# EAGLE design usb (EAGLE 7.5.0)
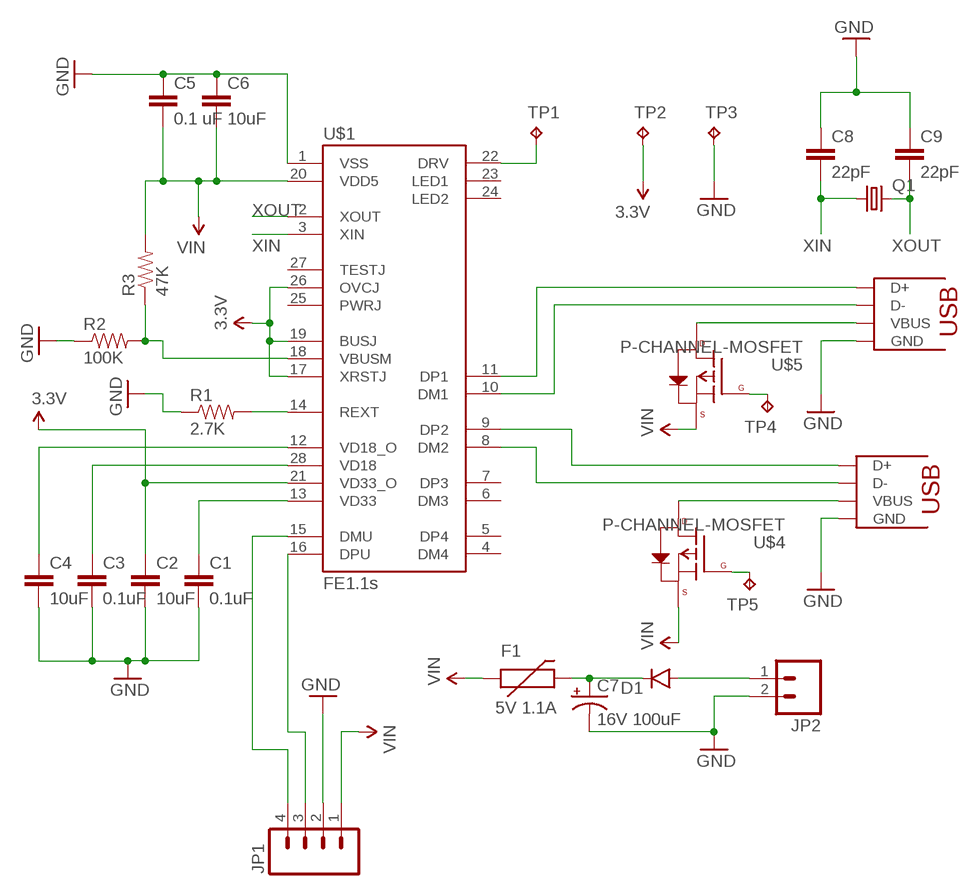
[diagram p0: schematic, sheet 1]

## Parts
C1  0.1uF  CAP1206  [1206]
C2  10uF  CAP1206  [1206]
C3  0.1uF  CAP1206  [1206]
C4  10uF  CAP1206  [1206]
C5  0.1 uF  CAP1206  [1206]
C6  10uF  CAP1206  [1206]
C7  16V 100uF  CAP_POLD  [PANASONIC_D]
C8  22pF  CAP1206  [1206]
C9  22pF  CAP1206  [1206]
D1  DIODESMA  [SMA-DIODE]
F1  5V 1.1A  PTCSMD  [PTC-1206]
JP1  M04LONGPADS  [1X04_LONGPADS]
JP2  M02PTH  [1X02]
Q1  CRYSTALCTS406  [CTS406]
R1  2.7K  RESISTOR1206  [1206]
R2  100K  RESISTOR1206  [1206]
R3  47K  RESISTOR1206  [1206]
TP1  TP_DRV  TPB2,54  [B2,54]
TP2  TP_DRV  TPB2,54  [B2,54]
TP3  TP_DRV  TPB2,54  [B2,54]
TP4  TP_DRV  TPB2,54  [B2,54]
TP5  TP_DRV  TPB2,54  [B2,54]
U$1  FE1.1S  [FE1.1S_SSOP-28]
U$2  USB-A-S  [USB-A-S-RA-PTH]
U$3  USB-A-S  [USB-A-S-RA-PTH]
U$4  P-CHANNEL-MOSFET  [SOT23-3]
U$5  P-CHANNEL-MOSFET  [SOT23-3]

## Nets
3.3V: C2.1 TP2.TP U$1.17(XRSTJ) U$1.19(BUSJ) U$1.21(VD33_O) U$1.26(OVCJ)
GND: C1.2 C2.2 C3.2 C4.2 C5.1 C6.1 C7.- C8.1 C9.1 JP1.2 JP2.2 R1.1 R2.1 TP3.TP U$1.1(VSS) U$2.GND U$2.GND2(GND) U$2.GND3(GND) U$3.GND U$3.GND2(GND) U$3.GND3(GND)
N$1: C1.1 U$1.13(VD33)
N$2: TP1.TP U$1.22(DRV)
N$3: C3.1 U$1.28(VD18)
N$4: C4.1 U$1.12(VD18_O)
N$5: D1.A JP2.1
N$6: C7.+ D1.C F1.2
N$7: R1.2 U$1.14(REXT)
N$8: U$3.VBUS U$4.3(D)
N$9: R2.2 R3.1 U$1.18(VBUSM)
N$10: U$2.VBUS U$5.3(D)
N$11: TP5.TP U$4.1(G)
N$12: TP4.TP U$5.1(G)
USB1_N: U$1.10(DM1) U$2.D-
USB1_P: U$1.11(DP1) U$2.D+
USB2_N: U$1.8(DM2) U$3.D-
USB2_P: U$1.9(DP2) U$3.D+
USBIN_N: JP1.4 U$1.15(DMU)
USBIN_P: JP1.3 U$1.16(DPU)
VIN: C5.2 C6.2 F1.1 JP1.1 R3.2 U$1.20(VDD5) U$4.2(S) U$5.2(S)
XIN: C8.2 Q1.1 U$1.3(XIN)
XOUT: C9.2 Q1.3 U$1.2(XOUT)
Unconnected: U$1.4(DM4) U$1.5(DP4) U$1.6(DM3) U$1.7(DP3) U$1.23(LED1) U$1.24(LED2) U$1.25(PWRJ) U$1.27(TESTJ)

## Library data of the parts
C1 C3 C5 = SparkFun-Capacitors:CAP: Capacitor Standard 0603 ceramic capacitor, and 0.1" leaded capacitor.; MF: TDK; MPN: CGA5L2C0G1H104J160AA; OC_FARNELL: 2211074
C2 C4 C6 = SparkFun-Capacitors:CAP: Capacitor Standard 0603 ceramic capacitor, and 0.1" leaded capacitor.; MF: TAIYO YUDEN; MPN: GMK316F106ZL-T; OC_FARNELL: 1611967
C7 = SparkFun-Capacitors:CAP_POL: Capacitor Polarized These are standard SMD and PTH capacitors. Normally 10uF, 47uF, and 100uF in electrolytic and tantalum varieties. Always verify the external diameter of the through hole cap, it varies with capacity, voltage, and manufacturer. The EIA devices should be standard.; MF: PANASONIC ELECTRONIC COMPONENTS; MPN: EEEHA1C101WP; OC_FARNELL: 1973308
C8 C9 = SparkFun-Capacitors:CAP: Capacitor Standard 0603 ceramic capacitor, and 0.1" leaded capacitor.; MF: AVX; MPN: 12061A220JAT2A; OC_FARNELL: 499249
D1 = SparkFun-DiscreteSemi:DIODE: Diode These are standard reverse protection diodes and small signal diodes. SMA package can handle up to about 1A. SOD-323 can handle about 200mA. What the SOD-323 package when ordering, there are some mfgs out there that are 5-pin packages.; MF: MULTICOMP; MPN: SMAJ5.0A; OC_FARNELL: 1578997
F1 = SparkFun-PowerIC:PTC: Resettable Fuse PTC Resettable Fuse. Spark Fun Electronics SKU : COM-08357; OC_FARNELL: unknown; PROD_ID: RES-11150
JP1 = SparkFun-Connectors:M04: Header 4 Standard 4-pin 0.1" header. Use with straight break away headers (SKU : PRT-00116), right angle break away headers (PRT-00553), swiss pins (PRT-00743), machine pins (PRT-00117), and female headers (PRT-00115). Molex polarized connector foot print use with SKU : PRT-08231 with associated crimp pins and housings. 1MM SMD Version SKU: PRT-10208; OC_FARNELL: unknown
JP2 = SparkFun-Connectors:M02: Standard 2-pin 0.1" header. Use with - straight break away headers ( PRT-00116) - right angle break away headers (PRT-00553) - swiss pins (PRT-00743) - machine pins (PRT-00117) - female headers (PRT-00115) Molex polarized connector foot print use with: PRT-08233 with associated crimp pins and housings. 2.54_SCREWTERM for use with PRT-10571. 3.5mm Screw Terminal footprints for PRT-08084 5mm Screw Terminal footprints for use with PRT-08432; OC_FARNELL: unknown
Q1 = crystal:CRYSTAL: CRYSTAL; MF: ABRACON; MPN: ABM3B-12.000MHZ-B2-T; OC_FARNELL: 1611810; OC_NEWARK: unknown
R1 = SparkFun-Passives:RESISTOR: Resistor Basic schematic elements and footprints for 0603, 1206, and PTH resistors.; MF: WELWYN; MPN: WCR1206-2K7FI; OC_FARNELL: 1100202
R2 = SparkFun-Passives:RESISTOR: Resistor Basic schematic elements and footprints for 0603, 1206, and PTH resistors.; MF: VISHAY; MPN: CRCW1206100KFKEA; OC_FARNELL: 1469975
R3 = SparkFun-Passives:RESISTOR: Resistor Basic schematic elements and footprints for 0603, 1206, and PTH resistors.; MF: VISHAY; MPN: CRCW120647K0FKEA; OC_FARNELL: 1470016
TP1-TP5 = testpad:TP: Test pad; OC_FARNELL: unknown
U$1 = imcom:FE1.1S: A USB 2.0 hub IC. http://www.jfd-ic.com/Documents/FE1.1s%20Data%20Sheet%20%28Rev.%201.0%29.pdf; OC_FARNELL: unknown
U$2 U$3 = pimoroni:USB-A-S; OC_FARNELL: unknown
U$4 U$5 = GeekAmmo:P-CHANNEL-MOSFET: P-Channel MOSFET Mode Field Effect Transistor; MF: VISHAY; MPN: SI2301CDS-T1-E3; OC_FARNELL: 2335284

## Board
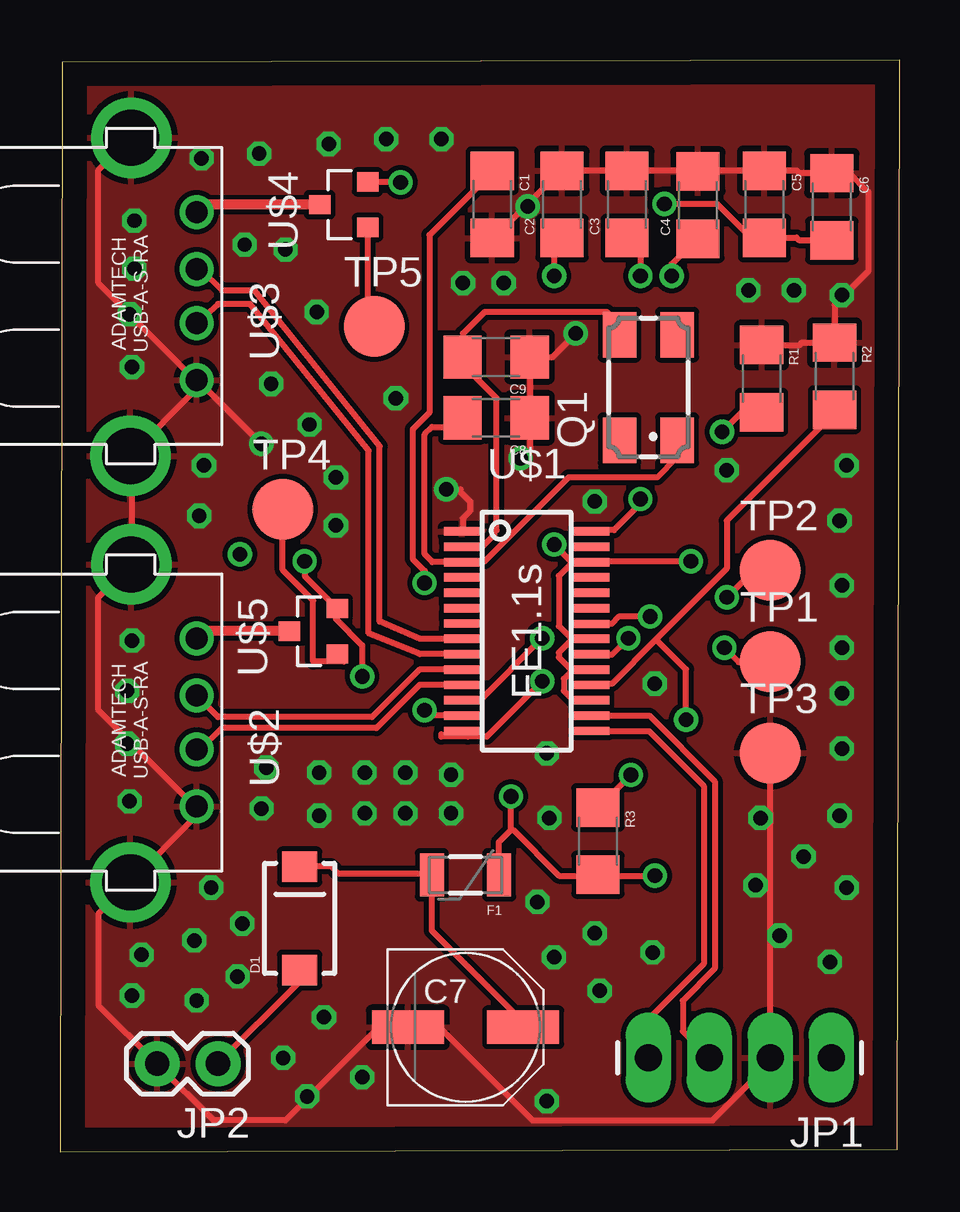
[diagram p1: board, top side]
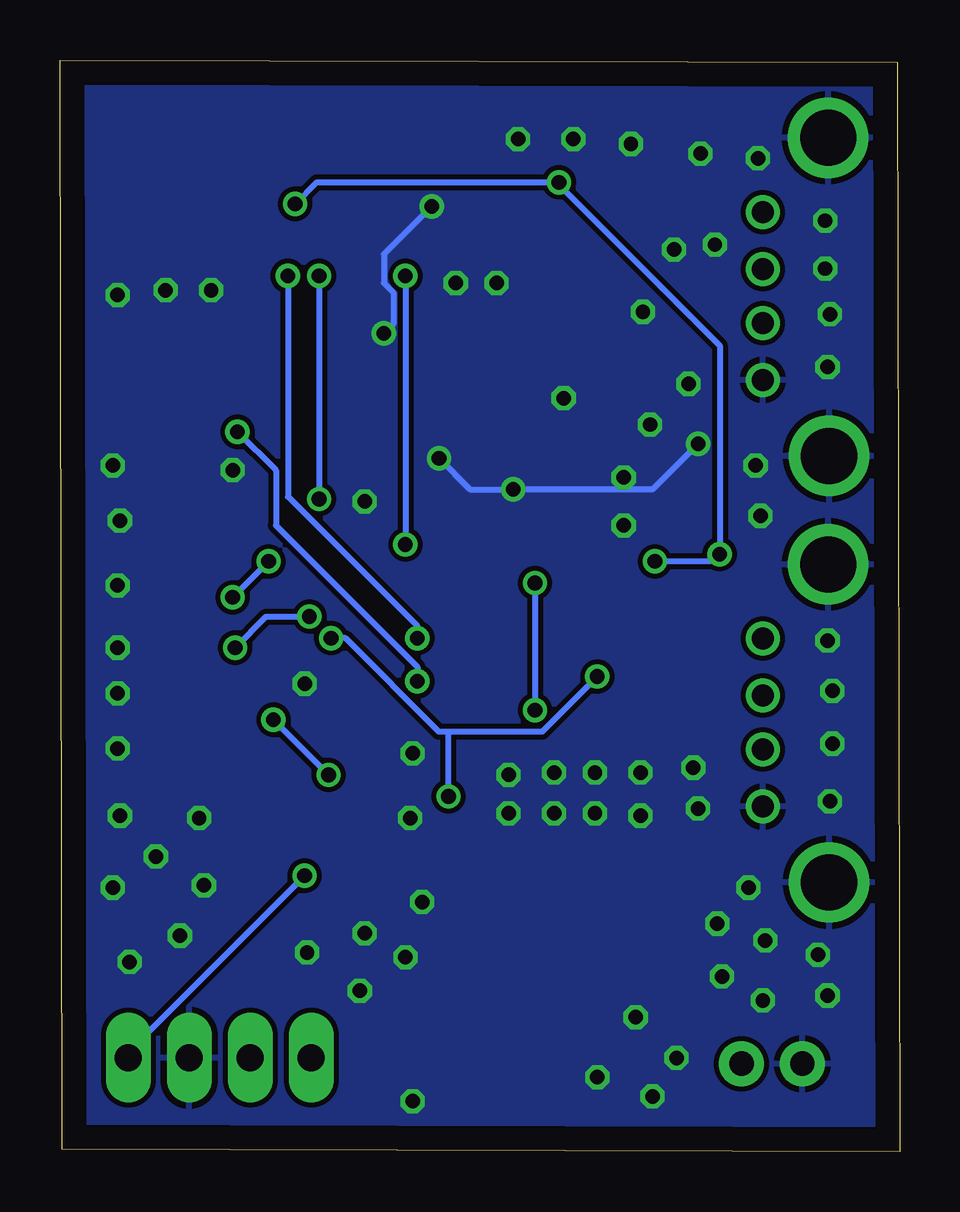
[diagram p2: board, bottom side, seen from below]

Size 35 x 45.5 mm. Coordinates in mm from the lower left corner, seen from the top.
Outline: 0,0 34.9,0.1 35,45.5 0.1,45.4 0,0
Copper layers (1*16): Top 0.035mm / dielectric 1.5mm / Bottom 0.035mm
Design rules "default": minimum track width 10mil, minimum drill 24mil, track to track 8mil, track to pad 8mil, pad to pad 8mil, via to via 8mil, smd to smd 8mil, copper to edge 40mil, drill to drill 8mil, minimum pad ring 10mil, minimum via ring 8mil, stop-mask expansion 4mil, vias tented up to drill 0mil, thermal gap 10mil

### Footprints (pad centres in the part's own frame; a part is rotated, then mirrored left to right if it is on the bottom)
1206 = smd 1.6 x 1.8: 1 -1.4,0; 2 1.4,0
PANASONIC_D = smd 3 x 1.4: + 2.4,0; - -2.4,0
SMA-DIODE = smd 1.27 x 1.47: A -2.15,0; C 2.15,0
PTC-1206 = smd 1 x 1.8: 1 -1.4,0; 2 1.4,0
1X04_LONGPADS = drill 1.118 pad 1.88 long: 1 0,0; 2 2.54,0; 3 5.08,0; 4 7.62,0
1X02 = drill 1.016 pad 1.88: 1 0,0; 2 2.54,0
CTS406 = smd 1.9 x 1.4: 1 -2.2,-1.2; 2 2.2,-1.2; 3 2.2,1.2; 4 -2.2,1.2
B2,54 = smd 2.54 x 2.54: TP 0,0
FE1.1S_SSOP-28 = smd 0.35 x 1.5: 1 -4.16,-2.7; 2 -3.52,-2.7; 3 -2.88,-2.7; 4 -2.24,-2.7; 5 -1.6,-2.7; 6 -0.96,-2.7; 7 -0.32,-2.7; 8 0.32,-2.7; 9 0.96,-2.7; 10 1.6,-2.7; 11 2.24,-2.7; 12 2.88,-2.7; 13 3.52,-2.7; 14 4.16,-2.7; 15 4.16,2.7; 16 3.52,2.7; 17 2.88,2.7; 18 2.24,2.7; 19 1.6,2.7; 20 0.96,2.7; 21 0.32,2.7; 22 -0.3,2.7; 23 -0.96,2.7; 24 -1.6,2.7; 25 -2.24,2.7; 26 -2.88,2.7; 27 -3.52,2.7; 28 -4.16,2.7
USB-A-S-RA-PTH = drill 0.914 pad 1.27: D+ 2.755,-1.127; D- 2.755,1.127; GND 2.755,-3.5; VBUS 2.755,3.5 | drill 2.337 pad 3.302: GND2 -0.003,-6.662; GND3 0.032,6.597
SOT23-3 = smd 0.8 x 0.9: 1 -0.95,-1; 2 0.95,-1; 3 0,1

### Placement (x,y rotation side)
C1  18.02,39.48 270 top
C2  20.93,39.48 90 top
C3  23.64,39.48 90 top
C4  26.59,39.45 90 top
C5  29.37,39.48 270 top
C6  32.18,39.38 270 top
C7  16.91,5.18 0 top
C8  18.18,30.58 180 top
C9  18.18,33.12 180 top
D1  9.99,9.72 90 top
F1  16.91,11.53 180 top
JP1  32.15,3.91 180 top
JP2  6.59,3.66 180 top
Q1  24.53,31.85 90 top
R1  29.25,32.22 270 top
R2  32.29,32.32 270 top
R3  22.43,12.94 270 top
TP1  29.61,20.42 0 top
TP2  29.61,24.23 0 top
TP3  29.61,16.61 0 top
TP4  9.29,26.77 0 top
TP5  13.1,34.39 0 top
U$1  19.45,21.69 270 top
U$2  2.94,17.88 0 top
U$3  2.94,35.66 0 top
U$4  11.83,39.47 90 top
U$5  10.56,21.69 90 top

### Tracks (layer width: path | path; a pad name or v marks a point on that pad's centre or on a via)
3.3V  (via drill 0.61)
  Top 0.254: 21.3,24.6 22.1,24.6 U$1.26 22.2,24.6 v26.3,24.6 | v20.6,25.3 21.3,24.6 | v20.6,36.5 20.6,38 20.7,38.1 20.9,38.1 C2.1 | 21.3,21.4 22.1,21.4 U$1.21 | 21.3,21.4 20.8,21.9 20.8,24 21.3,24.5 21.3,24.6 | 21.3,20.1 22.1,20.1 U$1.19 | 21.3,20.1 20.8,20.6 20.8,20.8 21.3,21.3 21.3,21.4 | U$1.17 22.1,18.8 21.4,18.8 21,19.2 21,19.7 21.3,20 21.3,20.1 | v27.8,23.1 28.9,24.2 29.6,24.2 TP2.TP
  Bottom 0.254: v20.6,36.5 v20.6,25.3 | v27.8,23.1 v26.3,24.6
GND  (via drill 0.6, 0.61)
  Top 0.254: 19.45,39.45 20.2,40.2 20.2,40.8 20.3,40.9 20.8,40.9 C2.2 21,40.9 23.6,40.9 C3.2 23.7,40.9 26.5,40.9 C4.2 26.7,40.9 29.3,40.9 C5.1 29.5,40.9 30.7,40.9 30.8,40.8 32.1,40.8 C6.1 32.3,40.8 32.9,40.8 33.7,40 33.7,36.7 32.3,35.3 32.3,33.8 R2.1 32.2,33.7 30.9,33.7 30.8,33.6 29.3,33.6 R1.1 | 19.45,39.45 18.1,38.1 C1.2 | v21.5,34.1 20.5,33.1 19.7,33.1 C9.1 19.6,33.1 19.6,30.6 C8.1 19.6,30.5 19.6,29.2 19.4,29 19.3,29 v19.2,28.9 | v19.5,39.4 19.45,39.45 | U$3.GND 5.6,32.1 5.6,31.7 3,29.1 U$3.GND2 3,28.9 3,24.6 U$2.GND3 2.9,24.4 1.6,23.1 1.6,18.4 5.6,14.4 U$2.GND 5.6,14.3 5.6,13.9 3,11.3 U$2.GND2 2.9,11.2 1.6,9.9 1.6,6.1 4,3.7 JP2.2 4.1,3.6 6.4,1.3 9.4,1.3 13.3,5.2 14.5,5.2 C7.- 14.6,5.2 15.8,5.2 19.7,1.3 27.2,1.3 29.6,3.7 JP1.2 29.6,4 29.6,16.5 29.5,16.6 29.6,16.7 TP3.TP | U$3.GND3 2.9,42.2 1.6,40.9 1.6,36.2 5.6,32.2 U$3.GND | v16.1,27.6 16.7,27.6 16.7,27.5 17.1,27.1 17.1,26.7 16.8,26.4 16.8,25.9 U$1.1 | v8.4,29.5 5.8,32.1 U$3.GND
  Bottom 0.254: v21.5,34.1 21.1,34.5 21.1,35.8 21.5,36.2 21.5,37.4 v19.5,39.4 | v8.4,29.5 10.3,27.6 v16.1,27.6 17.9,27.6 v19.2,28.9
  other vias: 10.8,15.8 12.7,15.8 14.4,15.8 16.3,15.7 16.3,14.1 14.4,14.1 12.7,14.1 10.8,14 8.4,14.3 8.6,16 6.3,11 7.6,9.5 5.6,8.8 7.4,7.3 5.7,6.3 3.4,8.2 3,6.5 9.3,3.9 11,5.6 12.6,3.1 10.3,2.3 20.3,2.1 22.5,6.7 20.6,8.1 22.3,9.1 24.7,8.3 19.9,10.4 29,11.1 30,9 32.1,7.9 32.8,11 32.5,14 31,12.3 29.2,13.9 32.6,16.8 32.6,19.1 32.6,21 32.6,23.6 32.5,26.3 32.8,28.6 27.8,28.4 32.6,35.7 30.6,35.9 28.7,35.9 18.5,36.2 16.8,36.2 8.8,32 10.4,30.3 11.5,28.1 11.5,26.1 14,31.4 10.7,35 9.4,37.6 7.7,37.8 3.1,38.8 3.1,36.8 2.9,34.9 3,32.7 6,28.6 5.8,26.5 3,21.3 2.8,19.2 2.8,17 2.9,14.6 5.9,41.4 8.3,41.6 11.2,42 13.6,42.2 15.9,42.2 22.3,27.1 24.8,19.5 20.3,16.6 20.4,13.9
  pour Top: 0,0 35,0.1 35.2,45.4 0,45.3
  pour Bottom: 0.3,45.2 35.1,45.3 35,44.3 34.9,44.3 34.9,0.1 0.2,0
N$1  (via drill 0.61)
  Top 0.254: v15.2,18.4 15.4,18.2 16.7,18.2 U$1.13 | v15.2,23.7 15.2,24.2 14.7,24.7 14.7,30.1 15.4,30.8 15.4,38.2 18,40.8 C1.1
  Bottom 0.254: v15.2,23.7 v15.2,18.4
N$2  (via drill 0.61)
  Top 0.254: v24.6,22.3 23.3,22.3 23,22 22.2,22 U$1.22 | v27.7,21 28.3,20.4 29.6,20.4 TP1.TP
  Bottom 0.254: v24.6,22.3 26.4,22.3 v27.7,21
N$3  (via drill 0.61)
  Top 0.254: 24.2,26.9 v24.2,27.2 24.1,26.9 23.1,25.9 22.2,25.9 U$1.28 | v24.2,36.5 24.2,38 24.1,38.1 23.7,38.1 C3.1
  Bottom 0.254: v24.2,36.5 v24.2,27.2
N$4  (via drill 0.61)
  Top 0.254: v20.1,21.4 17.5,18.8 16.8,18.8 U$1.12 | v25.5,36.5 25.5,37 26.5,38 C4.1
  Bottom 0.254: v20.1,21.4 20.1,21.9 25.5,27.3 v25.5,36.5
N$5
  Top 0.254: D1.A 9.9,7.5 9.9,7 6.6,3.7 JP2.1
N$6
  Top 0.254: D1.C 10,11.9 11.3,11.9 11.6,11.6 15.5,11.6 F1.2 15.5,11.5 15.5,9.2 19.5,5.2 19.4,5.1 C7.+
N$7  (via drill 0.61)
  Top 0.254: 15.9,17.4 15.9,17.3 17,17.3 | 17,17.3 17.8,17.3 v20.1,19.6 | v27.6,30 28.4,30.8 29.2,30.8 R1.2 | U$1.14 16.8,17.5 16.9,17.5 17,17.4 17,17.3
  Bottom 0.254: v20.1,19.6 20.1,20.2 26,26.1 26,28.4 v27.6,30
N$8
  Top 0.406: U$4.3 5.48,39.47 U$3.VBUS
N$9  (via drill 0.61)
  Top 0.254: 24.85,21.35 27.8,24.3 27.8,26.3 32.4,30.9 32.3,31 R2.2 | 24.85,21.35 23,19.5 22.2,19.5 U$1.18 | v26.1,18 26.1,20.1 24.85,21.35 | v23.8,15.7 22.5,14.4 R3.1
  Bottom 0.254: v23.8,15.7 v26.1,18
N$10
  Top 0.406: U$5.3 5.48,21.69 U$2.VBUS
N$11
  Top 0.254: U$4.1 12.83,34.66 TP5.TP
N$12
  Top 0.254: U$5.1 11.83,20.42 10.56,20.42 10.56,22.96 9.29,24.23 TP4.TP
USB1_N
  Top 0.254: U$1.10 14.99,20.09 13.01,18.11 6.59,18.11 U$2.D-
USB1_P
  Top 0.254: U$1.11 14.99,19.45 13.2,17.65 6.75,17.65 5.85,16.75 U$2.D+
USB2_N
  Top 0.254: U$1.8 15.01,21.37 13.33,22.09 13.33,29.41 8.12,35.89 6.75,35.89 5.85,36.79 U$3.D-
USB2_P
  Top 0.254: U$1.9 15.01,20.73 12.87,21.6 12.87,29.21 7.93,35.33 6.59,35.33 U$3.D+
USBIN_N
  Top 0.254: U$1.15 24.56,17.53 26.84,15.24 26.84,7.81 24.53,5.5 JP1.4
USBIN_P
  Top 0.254: U$1.16 24.56,18.17 27.3,15.44 27.3,7.62 25.96,6.29 25.96,5.02 JP1.3
VIN  (via drill 0.61)
  Top 0.254: C6.2 32.1,38 30.8,38 30.7,38.1 29.4,38.1 C5.2 29.3,38.1 28.8,38.1 27.4,39.5 v25.2,39.5 | v14.2,40.4 12.9,40.4 U$4.2 | v10.2,24.6 10.2,24 U$5.2 11.4,22.7 11.4,22.6 11.5,22.5 11.5,22.2 12.6,21.1 v12.6,19.8 | v23.7,21.4 23,20.7 22.2,20.7 U$1.20 | 18.8,13.4 v18.8,14.8 | 18.8,13.4 18.3,12.9 18.3,11.6 F1.1 | R3.2 22.4,11.5 20.8,11.5 18.9,13.4 18.8,13.4 | 22.9,11.4 22.8,11.5 22.5,11.5 R3.2 | v24.8,11.5 22.9,11.5 R3.2
  Bottom 0.254: v25.2,39.5 24.3,40.4 v14.2,40.4 14.2,40.3 7.5,33.6 v7.5,24.9 7.6,24.9 7.9,24.6 v10.2,24.6 | v23.7,21.4 23.1,21.4 19.2,17.5 18.8,17.5 | 18.8,17.5 14.9,17.5 v12.6,19.8 | v18.8,14.8 18.8,17.5 | v24.8,11.5 32.1,4.2 32.1,4 JP1.1
XIN
  Top 0.254: C8.2 16.4,30.2 15.5,30.2 15.2,29.9 15.2,24.9 15.53,24.57 U$1.3 16.8,24.6 17.7,24.6 21.2,28.1 24.9,28.1 25.7,28.9 25.7,29.6 Q1.1
XOUT
  Top 0.254: U$1.2 17.61,25.21 18.1,25.7 18.1,25.8 18.2,25.9 18.2,31.4 16.8,32.8 16.8,33.1 C9.2 16.8,33.2 16.8,34.1 17.7,35 22.8,35 23.3,34.5 23.3,34.1 Q1.3